# Altium schematic sheet Power_Input.SchDoc: Power Input
size OrCAD A; DocumentNumber: LM-008; Revision: B; SheetNumber: 1; SheetTotal: 6; DocumentName: LM-008
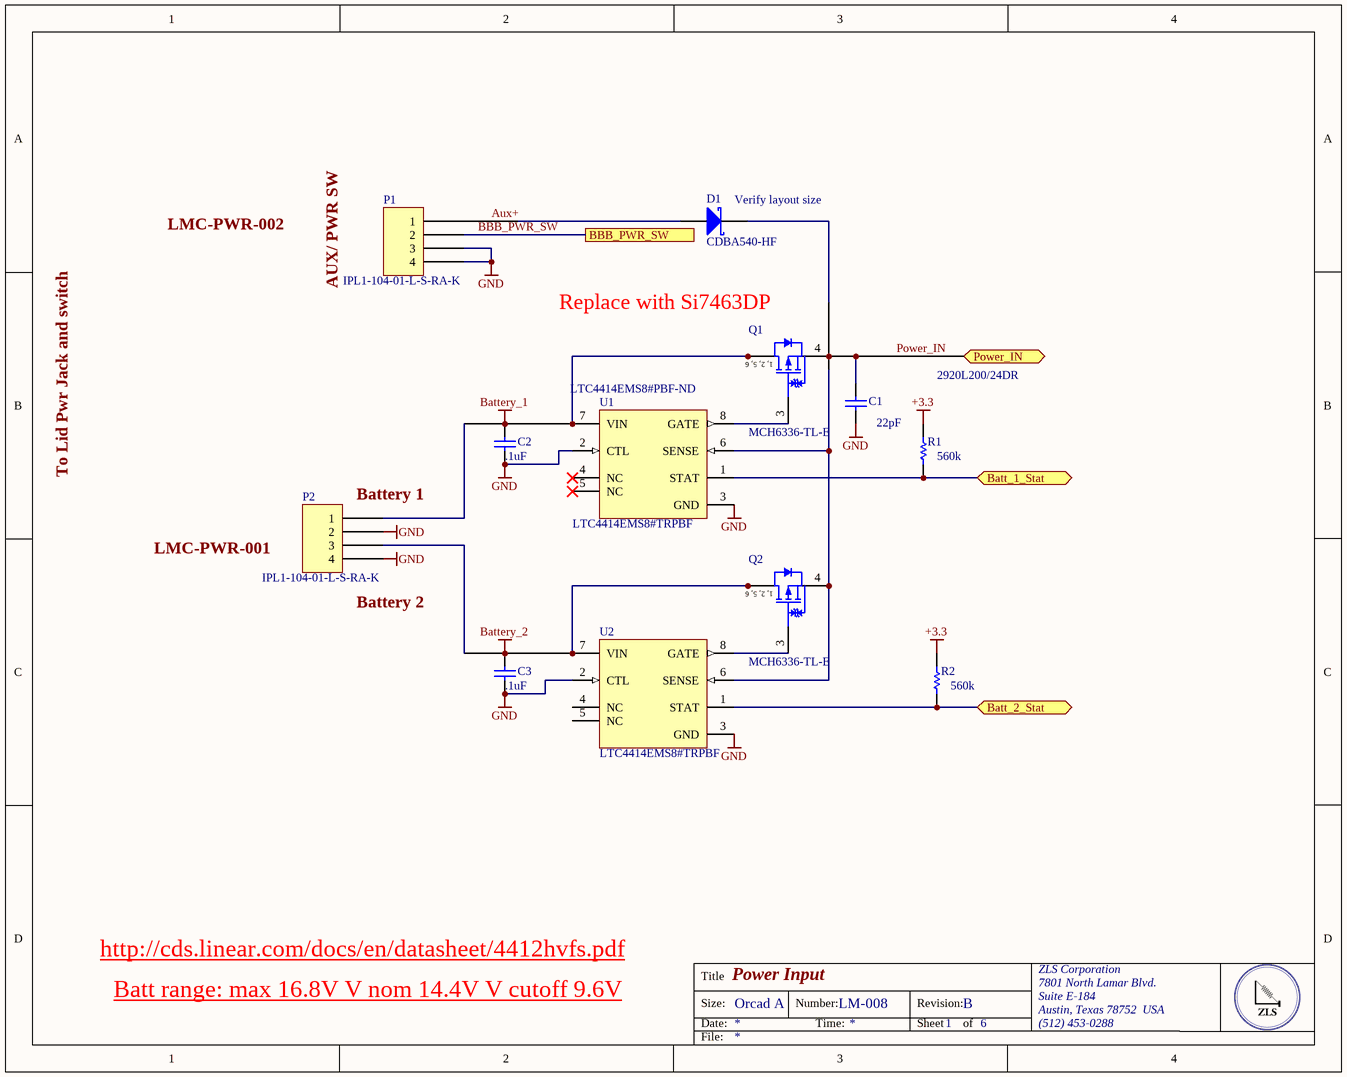
[diagram p0: Power_Input.SchDoc]

## Parts
C1  Capacitance: 22pF  [CAPC1206(3216)130_N]  (hidden comment: CAP CER 10UF 6.3V X5R 1206)
C2  Capacitance: .1uF  [CAPC1206(3216)130_N]  (hidden comment: CAP CER 10UF 6.3V X5R 1206)
C3  Capacitance: .1uF  [CAPC1206(3216)130_N]  (hidden comment: CAP CER 10UF 6.3V X5R 1206)
D1  CDBA540-HF  [VISH-DO-214AC-2_M]
P1  IPL1-104-01-L-S-RA-K  [IPL1-104-01-L-S-RA-K]
P2  IPL1-104-01-L-S-RA-K  [IPL1-104-01-L-S-RA-K]
Q1  MCH6336-TL-E  [ONSC-MCPH-6_V]
Q2  MCH6336-TL-E  [ONSC-MCPH-6_V]
R1  560k  [RESC0402(1005)_L]
R2  560k  [RESC0402(1005)_L]
U1  LTC4414EMS8#TRPBF  Supplier Part Number 1: LTC4414EMS8#PBF-ND  [LT-MS8-8_L]
U2  LTC4414EMS8#TRPBF  [LT-MS8-8_L]

## Ports
Batt_1_Stat, Batt_2_Stat, BBB_PWR_SW, Power_IN

## Nets
+3.3: R1.2 R2.2
Battery_1: C2.2 P2.1 Q1.1(D) Q1.2(D) Q1.5(D) Q1.6(D) U1.7(VIN)
Battery_2: C3.2 P2.3 Q2.1(D) Q2.2(D) Q2.5(D) Q2.6(D) U2.7(VIN)
GND: C1.1 C2.1 C3.1 P1.3 P1.4 P2.2 P2.4 U1.2(CTL) U1.3(GND) U2.2(CTL) U2.3(GND)
Aux+: D1.1(A) P1.1
Batt_1_Stat: R1.1 U1.1(STAT) ; port Batt_1_Stat
Batt_2_Stat: R2.1 U2.1(STAT) ; port Batt_2_Stat
BBB_PWR_SW: P1.2 ; port BBB_PWR_SW
Power_IN: C1.2 D1.2(K) Q1.4(S) Q2.4(S) U1.6(SENSE) U2.6(SENSE) ; port Power_IN
NetQ1_3: Q1.3(G) U1.8(GATE)
NetQ2_3: Q2.3(G) U2.8(GATE)

Not connected (* = marked no-connect by the designer): U1 4(NC)* 5(NC)*; U2 4(NC) 5(NC)

## Notes on the sheet
- (near D1) Verify layout size
- LMC-PWR-002
- AUX/ PWR SW
- (near Q1) Replace with Si7463DP
- 2920L200/24DR
- To Lid Pwr Jack and switch
- LMC-PWR-001
- (near P2) Battery 1
- (near P2) Battery 2
- http://cds.linear.com/docs/en/datasheet/4412hvfs.pdf
- Batt range: max 16.8V V nom 14.4V V cutoff 9.6V
- Title
- Size:
- Date:
- Orcad A
- Number:
- Time:
- Revision:
- Sheet
- of
- ZLS Corporation
- 7801 North Lamar Blvd.
- Suite E-184
- Austin, Texas 78752  USA
- (512) 453-0288
- File:
- (in symbol CMP-1058-00598-1) 1, 2, 5, 6

## Library data of the parts
C1-C3 = CMP-1037-04913-1: Manufacturer: Taiyo Yuden; Manufacturer Part Number: JMK316BJ106ML-T; Tolerance: ±20%; Notification: Current market demand for these product types have resulted in fluctuating and extending lead times. Lead times may differ.; Supplier 1: Digi-Key; Supplier Part Number 1: 587-5447-1-ND; RoHS: RoHS Compliant; Category: Capacitors; Stock 1: 5600; Pricing 1: 1=0.24, 10=0.161, 100=0.0817, 500=0.05592, 1000=0.04946 (USD); Packaging: Cut Tape (CT); Part Status: Active; Voltage - Rated: 6.3V; Temperature Coefficient: X5R; Operating Temperature: -55°C ~ 85°C; Features: -; Ratings: -; Applications: SMPS Filtering; Failure Rate: -; Mounting Type: Surface Mount, MLCC; Package / Case: 1206 (3216 Metric); Size / Dimension: 0.126" L x 0.063" W (3.20mm x 1.60mm); Height - Seated (Max): -; Thickness (Max): 0.071" (1.80mm); Lead Spacing: -; Lead Style: -; ComponentLink1URL: http://ds.yuden.co.jp/TYCOMPAS/ut/detail.do?productNo=JMK316BJ106ML-T&fileName=JMK316BJ106ML-T_SS&mode=specSheetDownload; ComponentLink1Description: http://ds.yuden.co.jp/TYCOMPAS/ut/detail.do?productNo=JMK316BJ106ML-T&fileName=JMK316BJ106ML-T_SS&mode=specSheetDownload
D1 = D Schottky: DIODE SCHOTTKY 40V 5A DO214AB; Manufacturer: Comchip Technology; Speed: Fast Recovery =< 500ns, > 200mA (Io); Capacitance @ Vr, F: 380pF @ 4V, 1MHz; Supplier 1: Digi-Key; Supplier Part Number 1: 641-1707-6-ND; Manufacturer Part Number: CDBA540-HF; RoHS: RoHS Compliant; Category: Discrete Semiconductor Products; Stock 1: 7367; Pricing 1: 1=0.49, 10=0.381, 25=0.3208, 100=0.2612, 250=0.2164, 500=0.1791, 1000=0.13432, 2500=0.12313 (USD); Packaging: Digi-Reel®; Part Status: Active; Diode Type: Schottky; Current - Average Rectified (Io): 5A; Mounting Type: Surface Mount; Package / Case: DO-214AC, SMA; Supplier Device Package: DO-214AC (SMA); Operating Temperature - Junction: -50°C ~ 150°C; ComponentLink1URL: http://www.comchiptech.com/cms/UserFiles/CDBA540-HF%20Thru505315.%20CDBA5200-HF%20RevC.pdf; ComponentLink1Description: http://www.comchiptech.com/cms/UserFiles/CDBA540-HF%20Thru505315.%20CDBA5200-HF%20RevC.pdf
P1 P2 = IPL1-104-01-L-S-RA-K: Manufacturer: Samtec Inc.; Connector Type: Header; Pitch - Mating: 0.100" (2.54mm); Number of Positions: 4; Number of Positions Loaded: All; Style: Board to Cable/Wire; Shrouding: Shrouded - 4 Wall; Contact Length - Mating: 0.215" (5.46mm); Contact Length - Post: 0.085" (2.16mm); Material Flammability Rating: UL94 V-0; Voltage Rating: 675VAC, 954VDC; Supplier 1: Digi-Key; Supplier Part Number 1: SAM9597-ND; Manufacturer Part Number: IPL1-104-01-L-S-RA-K; RoHS: RoHS Compliant; Category: Connectors, Interconnects; Stock 1: 265; Pricing 1: 1=2.53, 10=2.424, 100=2.02, 500=1.717, 1000=1.4645, 5000=1.313 (USD); Packaging: Tube; Part Status: Active; Contact Type: Male Pin; Number of Rows: 1; Row Spacing - Mating: -; Mounting Type: Through Hole, Right Angle; Termination: Solder; Fastening Type: Locking Ramp; Overall Contact Length: -; Insulation Height: 0.240" (6.10mm); Contact Shape: Square; Contact Finish - Mating: Gold; Contact Finish Thickness - Mating: 10µin (0.25µm); Contact Finish - Post: Tin; Contact Material: Phosphor Bronze; Insulation Material: Liquid Crystal Polymer (LCP); Features: -; Operating Temperature: -55°C ~ 125°C; Ingress Protection: -; Insulation Color: Natural; Current Rating: -; Mated Stacking Heights: -; Contact Finish Thickness - Post: -; Applications: -; ComponentLink1URL: http://suddendocs.samtec.com/prints/ipl1-1xx-xx-xxx-s-xx-x-xx-mkt.pdf; ComponentLink1Description: http://suddendocs.samtec.com/prints/ipl1-1xx-xx-xxx-s-xx-x-xx-mkt.pdf
Q1 Q2 = CMP-1058-00598-1: P-Channel Power MOSFET, -12 V, -5 A, 43 mOhm, Single, 6-Pin MCPH, Pb-Free, Tape and Reel; Manufacturer: ON Semiconductor; Current - Continuous Drain (Id) @ 25°C: 5A (Ta); Drive Voltage (Max Rds On,  Min Rds On): 1.8V, 4.5V; Rds On (Max) @ Id, Vgs: 43 mOhm @ 3A, 4.5V; Vgs(th) (Max) @ Id: 1.4V @ 1mA; Vgs (Max): ±10V; Power Dissipation (Max): 1.5W (Ta); Supplier 1: Digi-Key; Supplier Part Number 1: MCH6336-TL-EOSCT-ND; Manufacturer Part Number: MCH6336-TL-E; RoHS: Request Inventory Verification; Category: Discrete Semiconductor Products; Stock 1: 3000; Pricing 1: 1=0.68, 10=0.569, 100=0.4264, 500=0.3127, 1000=0.24164 (USD); Packaging: Cut Tape (CT); Part Status: Active; FET Type: P-Channel; Technology: MOSFET (Metal Oxide); FET Feature: -; Operating Temperature: 150°C (TJ); Mounting Type: Surface Mount; Supplier Device Package: SC-88FL/MCPH6; Package / Case: 6-SMD, Flat Leads; ComponentLink1URL: http://www.onsemi.com/pub/Collateral/MCH6336-D.PDF; ComponentLink1Description: http://www.onsemi.com/pub/Collateral/MCH6336-D.PDF
R1 R2 = CMP-1011-00927-1: RES SMD 560K OHM 1% 1/10W 0402; Manufacturer: Panasonic Electronic Components; Manufacturer Part Number: ERJ-2RKF5603X; Power (Watts): 0.1W, 1/10W; Temperature Coefficient: ±100ppm/°C; Supplier 1: Digi-Key; Supplier Part Number 1: P560KLCT-ND; RoHS: RoHS Compliant; Category: Resistors; Stock 1: 193515; Pricing 1: 1=0.1, 10=0.056, 100=0.0227, 1000=0.01021, 2500=0.00886, 5000=0.00732 (USD); Packaging: Cut Tape (CT); Part Status: Active; Tolerance: ±1%; Composition: Thick Film; Features: Automotive AEC-Q200; Operating Temperature: -55°C ~ 155°C; Package / Case: 0402 (1005 Metric); Supplier Device Package: 0402; Size / Dimension: 0.039" L x 0.020" W (1.00mm x 0.50mm); Height - Seated (Max): 0.016" (0.40mm); Failure Rate: -; ComponentLink1URL: https://industrial.panasonic.com/cdbs/www-data/pdf/RDA0000/AOA0000C304.pdf; ComponentLink1Description: https://industrial.panasonic.com/cdbs/www-data/pdf/RDA0000/AOA0000C304.pdf
U1 U2 = CMP-0479-00214-1: Low Loss PowerPath Controller for Large PFET, 3 to 36 V Vin, 8-pin SOP (MS8-8), -40 to 85 degC, Pb-Free, Tape and Reel; Manufacturer: Linear Technology/Analog Devices; Manufacturer Part Number: LTC4414EMS8#PBF; FET Type: P-Channel; Ratio - Input:Output: 2:1; Internal Switch(s): No; Voltage - Supply: 3 V ~ 36 V; Supplier 1: Digi-Key; RoHS: RoHS Compliant; Category: Integrated Circuits (ICs); Stock 1: 414; Pricing 1: 1=3.79, 25=2.6928, 100=2.2236 (USD); Packaging: Tube; Part Status: Active; Type: Source Selector Switch; Current - Output (Max): -; Applications: Battery Backup, Industrial/Automotive, High Current Switch; Operating Temperature: -40°C ~ 85°C; Mounting Type: Surface Mount; Package / Case: 8-TSSOP, 8-MSOP (0.118", 3.00mm Width); Supplier Device Package: 8-MSOP; Base Part Number: LTC4414; ComponentLink1URL: http://www.linear.com/docs/9037; ComponentLink1Description: http://www.linear.com/docs/9037
  U2: Supplier Part Number 1: LTC4414EMS8#PBF-ND